# Altium schematic sheet ADC.SchDoc
size A4; SheetNumber: 3; SheetTotal: 5
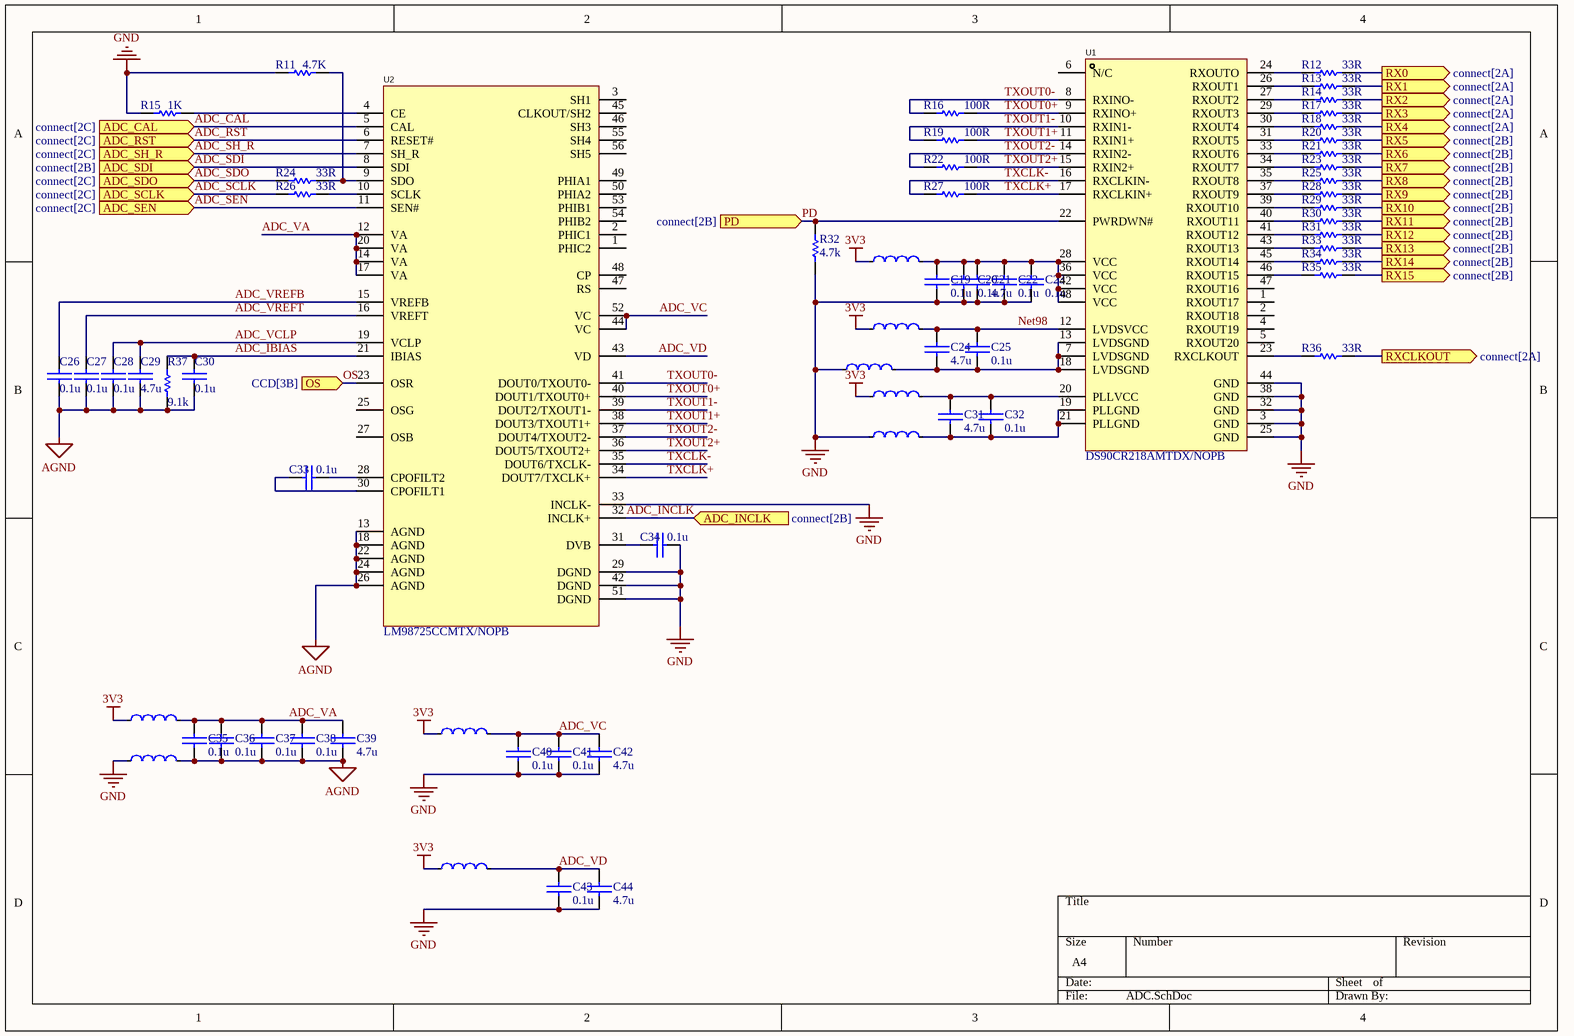
[diagram p0: ADC.SchDoc]

## Parts
C19  0.1u  [0603C]
C20  0.1u  [0603C]
C21  4.7u  [0603C]
C22  0.1u  [0603C]
C23  0.1u  [0603C]
C24  4.7u  [0603C]
C25  0.1u  [0603C]
C26  0.1u  [0603C]
C27  0.1u  [0603C]
C28  0.1u  [0603C]
C29  4.7u  [0603C]
C30  0.1u  [0603C]
C31  4.7u  [0603C]
C32  0.1u  [0603C]
C33  0.1u  [0603C]
C34  0.1u  [0603C]
C35  0.1u  [0603C]
C36  0.1u  [0603C]
C37  0.1u  [0603C]
C38  0.1u  [0603C]
C39  4.7u  [0603C]
C40  0.1u  [0603C]
C41  0.1u  [0603C]
C42  4.7u  [0603C]
C43  0.1u  [0603C]
C44  4.7u  [0603C]
L4  GZ1608D601TF  [0603L]  (value not drawn)
L5  GZ1608D601TF  [0603L]  (value not drawn)
L6  GZ1608D601TF  [0603L]  (value not drawn)
L7  GZ1608D601TF  [0603L]  (value not drawn)
L8  GZ1608D601TF  [0603L]  (value not drawn)
L9  GZ1608D601TF  [0603L]  (value not drawn)
L10  GZ1608D601TF  [0603L]  (value not drawn)
L11  GZ1608D601TF  [0603L]  (value not drawn)
L12  GZ1608D601TF  [0603L]  (value not drawn)
R11  4.7K  [0603R]
R12  33R  [0603R]
R13  33R  [0603R]
R14  33R  [0603R]
R15  1K  [0603R]
R16  100R  [0603R]
R17  33R  [0603R]
R18  33R  [0603R]
R19  100R  [0603R]
R20  33R  [0603R]
R21  33R  [0603R]
R22  100R  [0603R]
R23  33R  [0603R]
R24  33R  [0603R]
R25  33R  [0603R]
R26  33R  [0603R]
R27  100R  [0603R]
R28  33R  [0603R]
R29  33R  [0603R]
R30  33R  [0603R]
R31  33R  [0603R]
R32  4.7k  [0603R]
R33  33R  [0603R]
R34  33R  [0603R]
R35  33R  [0603R]
R36  33R  [0603R]
R37  9.1k  [0603R]
U1  DS90CR218AMTDX/NOPB  [TSSOP-48]
U2  LM98725CCMTX/NOPB  [TSSOP-56]

## Ports
ADC_CAL (in, see connect[2C]), ADC_INCLK (in, see connect[2B]), ADC_RST (in, see connect[2C]), ADC_SCLK (in, see connect[2C]), ADC_SDI (in, see connect[2B]), ADC_SDO (in, see connect[2C]), ADC_SEN (in, see connect[2C]), ADC_SH_R (in, see connect[2C]), OS (in, see CCD[3B]), PD (in, see connect[2B]), RX0 (out, see connect[2A]), RX1 (out, see connect[2A]), RX2 (out, see connect[2A]), RX3 (out, see connect[2A]), RX4 (out, see connect[2A]), RX5 (out, see connect[2B]), RX6 (out, see connect[2B]), RX7 (out, see connect[2B]), RX8 (out, see connect[2B]), RX9 (out, see connect[2B]), RX10 (out, see connect[2B]), RX11 (out, see connect[2B]), RX12 (out, see connect[2B]), RX13 (out, see connect[2B]), RX14 (out, see connect[2B]), RX15 (out, see connect[2B]), RXCLKOUT (out, see connect[2A])

## Nets
3V3: L4.1 L5.1 L7.1 L9.1 L10.1 L12.1
AGND: C26.2 C27.2 C28.2 C29.2 C30.2 C35.1 C36.1 C37.1 C38.1 C39.1 L11.2 R37.1 U2.13(AGND) U2.18(AGND) U2.22(AGND) U2.24(AGND) U2.26(AGND)
GND: C19.1 C20.1 C21.1 C22.1 C23.1 C34.2 C40.1 C41.1 C42.1 C43.1 C44.1 L6.1 L8.1 L11.1 R11.1 R15.1 R32.1 U1.3(GND) U1.25(GND) U1.32(GND) U1.38(GND) U1.44(GND) U2.29(DGND) U2.33(INCLK-) U2.42(DGND) U2.51(DGND)
ADC_CAL: U2.5(CAL) ; port ADC_CAL
ADC_IBIAS: C30.1 R37.2 U2.21(IBIAS)
ADC_INCLK: U2.32(INCLK+) ; port ADC_INCLK
ADC_RST: U2.6(RESET#) ; port ADC_RST
ADC_SCLK: R26.1 ; port ADC_SCLK
ADC_SDI: U2.8(SDI) ; port ADC_SDI
ADC_SDO: R24.1 ; port ADC_SDO
ADC_SEN: U2.11(SEN#) ; port ADC_SEN
ADC_SH_R: U2.7(SH_R) ; port ADC_SH_R
ADC_VA: C35.2 C36.2 C37.2 C38.2 C39.2 L9.2 U2.12(VA) U2.14(VA) U2.17(VA) U2.20(VA)
ADC_VC: C40.2 C41.2 C42.2 L10.2 U2.44(VC) U2.52(VC)
ADC_VCLP: C28.1 C29.1 U2.19(VCLP)
ADC_VD: C43.2 C44.2 L12.2 U2.43(VD)
ADC_VREFB: C26.1 U2.15(VREFB)
ADC_VREFT: C27.1 U2.16(VREFT)
Net98: C24.2 C25.2 L5.2 U1.12(LVDSVCC)
OS: U2.23(OSR) ; port OS
PD: R32.2 U1.22(PWRDWN#) ; port PD
RX0: R12.2 ; port RX0
RX1: R13.2 ; port RX1
RX2: R14.2 ; port RX2
RX3: R17.2 ; port RX3
RX4: R18.2 ; port RX4
RX5: R20.2 ; port RX5
RX6: R21.2 ; port RX6
RX7: R23.2 ; port RX7
RX8: R25.2 ; port RX8
RX9: R28.2 ; port RX9
RX10: R29.2 ; port RX10
RX11: R30.2 ; port RX11
RX12: R31.2 ; port RX12
RX13: R33.2 ; port RX13
RX14: R34.2 ; port RX14
RX15: R35.2 ; port RX15
RXCLKOUT: R36.2 ; port RXCLKOUT
TXCLK+: R27.2 U1.17(RXCLKIN+) U2.34(DOUT7/TXCLK+)
TXCLK-: R27.1 U1.16(RXCLKIN-) U2.35(DOUT6/TXCLK-)
TXOUT0+: R16.2 U1.9(RXINO+) U2.40(DOUT1/TXOUT0+)
TXOUT0-: R16.1 U1.8(RXINO-) U2.41(DOUT0/TXOUT0-)
TXOUT1+: R19.2 U1.11(RXIN1+) U2.38(DOUT3/TXOUT1+)
TXOUT1-: R19.1 U1.10(RXIN1-) U2.39(DOUT2/TXOUT1-)
TXOUT2+: R22.2 U1.15(RXIN2+) U2.36(DOUT5/TXOUT2+)
TXOUT2-: R22.1 U1.14(RXIN2-) U2.37(DOUT4/TXOUT2-)
NetC19_2: C19.2 C20.2 C21.2 C22.2 C23.2 L4.2 U1.28(VCC) U1.36(VCC) U1.42(VCC) U1.48(VCC)
NetC24_1: C24.1 C25.1 L6.2 U1.7(LVDSGND) U1.13(LVDSGND) U1.18(LVDSGND)
NetC31_1: C31.1 C32.1 L8.2 U1.19(PLLGND) U1.21(PLLGND)
NetC31_2: C31.2 C32.2 L7.2 U1.20(PLLVCC)
NetC33_1: C33.1 U2.30(CPOFILT1)
NetC33_2: C33.2 U2.28(CPOFILT2)
NetC34_1: C34.1 U2.31(DVB)
NetR11_2: R11.2 R24.2 U2.9(SDO)
NetR12_1: R12.1 U1.24(RXOUTO)
NetR13_1: R13.1 U1.26(RXOUT1)
NetR14_1: R14.1 U1.27(RXOUT2)
NetR15_2: R15.2 U2.4(CE)
NetR17_1: R17.1 U1.29(RXOUT3)
NetR18_1: R18.1 U1.30(RXOUT4)
NetR20_1: R20.1 U1.31(RXOUT5)
NetR21_1: R21.1 U1.33(RXOUT6)
NetR23_1: R23.1 U1.34(RXOUT7)
NetR25_1: R25.1 U1.35(RXOUT8)
NetR26_2: R26.2 U2.10(SCLK)
NetR28_1: R28.1 U1.37(RXOUT9)
NetR29_1: R29.1 U1.39(RXOUT10)
NetR30_1: R30.1 U1.40(RXOUT11)
NetR31_1: R31.1 U1.41(RXOUT12)
NetR33_1: R33.1 U1.43(RXOUT13)
NetR34_1: R34.1 U1.45(RXOUT14)
NetR35_1: R35.1 U1.46(RXOUT15)
NetR36_1: R36.1 U1.23(RXCLKOUT)

Not connected (* = marked no-connect by the designer): U1 1(RXOUT17) 2(RXOUT18) 4(RXOUT19) 5(RXOUT20) 6(N/C) 47(RXOUT16); U2 1(PHIC2) 2(PHIC1) 3(SH1) 25(OSG) 27(OSB) 45(CLKOUT/SH2) 46(SH3) 47(RS) 48(CP) 49(PHIA1) 50(PHIA2) 53(PHIB1) 54(PHIB2) 55(SH4) 56(SH5)

## Library data of the parts
C19-C44 = CAP: 无极性电容
L4-L12 = FB: 铁氧体磁珠; Manufacturer: Sunlord(顺络); Add into BOM: yes; Impedance @ Frequency: 600Ω@100MHz; Tolerance: ±25%; DC Resistance: 450mΩ; Current Rating: 200mA; Circuits: 1; Name: GZ1608D601TF; Symbol: GZ1608D601TF; Device: GZ1608D601TF; LCSC Part Name: 600Ω@100MHz ±25%; Supplier Part: C1002; Manufacturer Part: GZ1608D601TF; Supplier Footprint: 0603; JLCPCB Part Class: Basic Part; Datasheet: https://atta.szlcsc.com/upload/public/pdf/source/20210830/355EA7C0FAC5394FC0FE3F17C770C20A.pdf; Supplier: LCSC; Convert to PCB: yes
R11-R37 = RES: 电阻
U1 = DS90CR218AMTDX/NOPB: 解串芯片; Manufacturer: TI(德州仪器); Add into BOM: yes; Name: DS90CR218AMTDX/NOPB; Symbol: DS90CR218AMTDX/NOPB; Device: DS90CR218AMTDX/NOPB; LCSC Part Name: DS90CR218AMTDX/NOPB; Supplier Part: C2674207; Manufacturer Part: DS90CR218AMTDX/NOPB; Supplier Footprint: TSSOP-48; JLCPCB Part Class: Extended Part; Supplier: LCSC; Convert to PCB: yes
U2 = LM98725CCMTX/NOPB: CCD专用ADC; Manufacturer: TI(德州仪器); Add into BOM: yes; Name: LM98725CCMTX/NOPB; Symbol: LM98725CCMTX/NOPB; Device: LM98725CCMTX/NOPB; LCSC Part Name: LM98725CCMTX/NOPB; Supplier Part: C2679405; Manufacturer Part: LM98725CCMTX/NOPB; Supplier Footprint: TSSOP-56; JLCPCB Part Class: Extended Part; Supplier: LCSC; Convert to PCB: yes